# Altium schematic sheet 7I92ETH.SchDoc
size B
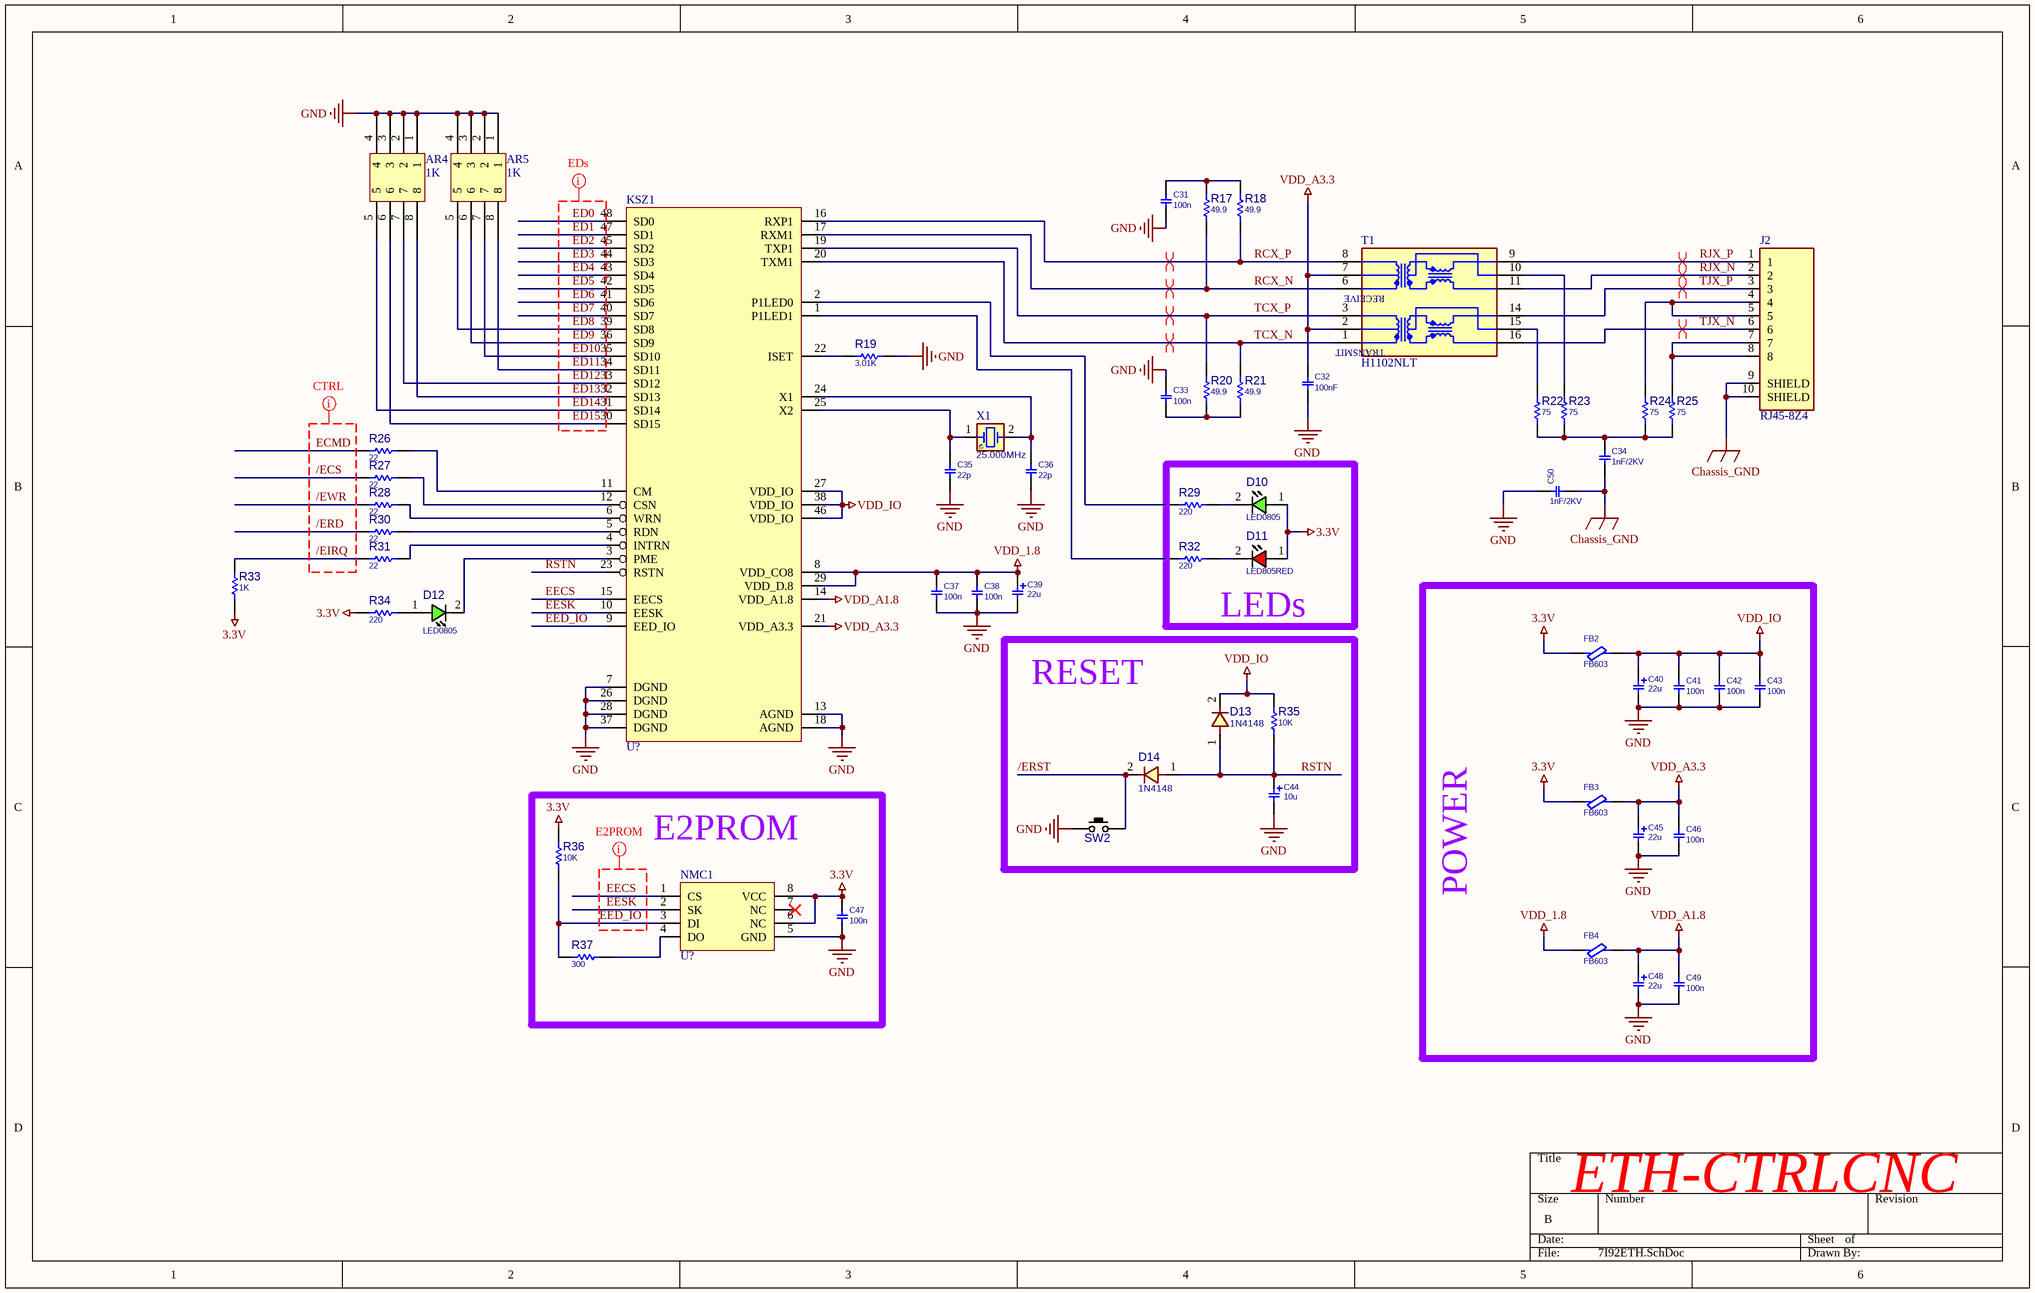
[diagram p0: 7I92ETH.SchDoc]

## Parts
AR4  1K  [RP0603X4]
AR5  1K  [RP0603X4]
C31  100n  [C0603]
C32  100nF  [C0603]
C33  100n  [C0603]
C34  1nF/2KV  [C1812]
C35  22p  [C0603]
C36  22p  [C0603]
C37  100n  [C0603]
C38  100n  [C0603]
C39  22u  [C_TN_3216]
C40  22u  [C_TN_3216]
C41  100n  [C0603]
C42  100n  [C0603]
C43  100n  [C0603]
C44  10u  [C_TN_3216]
C45  22u  [C_TN_3216]
C46  100n  [C0603]
C47  100n  [C0603]
C48  22u  [C_TN_3216]
C49  100n  [C0603]
C50  1nF/2KV  [C1812]
D10  LED0805  [LED0805]
D11  LED805RED  [LED0805RED]
D12  LED0805  [LED0805]
D13  1N4148  [D_SOD80]
D14  1N4148  [D_SOD80]
FB2  FB603  [L1206]
FB3  FB603  [L1206]
FB4  FB603  [L1206]
J2  RJ45-8Z4  [TE_RJ45-8Z4]
KSZ1  U?  [QFG50_48]
NMC1  U?  [SO_8]
R17  49.9  [R0603]
R18  49.9  [R0603]
R19  3.01K  [R0805]
R20  49.9  [R0603]
R21  49.9  [R0603]
R22  75  [R0805]
R23  75  [R0805]
R24  75  [R0805]
R25  75  [R0805]
R26  22  [R0603]
R27  22  [R0603]
R28  22  [R0603]
R29  220  [R0805]
R30  22  [R0603]
R31  22  [R0603]
R32  220  [R0805]
R33  1K  [R0603]
R34  220  [R0603]
R35  10K  [R0603]
R36  10K  [R0603]
R37  300  [R0603]
SW2  PUSHBUTTON  [SWPBS_SPST_6X3X5]  (value not drawn)
T1  H1102NLT  [XFMR_H1102NLT]
X1  25.000MHz  [XTLT_2]

## Blocks framed on the sheet
LEDs: D10 D11 R29 R32
POWER: C40-C43 C45 C46 C48 C49 FB2-FB4
RESET: C44 D13 D14 R35 SW2
E2PROM: C47 NMC1 R36 R37

## Nets
3.3V: C47.1 D10.1(ANODE) D11.1(ANODE) FB2.1 FB3.1 NMC1.6(NC) NMC1.8(VCC) R33.2 R34.2 R36.1
Chassis_GND: C34.2 C50.2 J2.9(SHIELD) J2.10(SHIELD)
GND: AR4.1 AR4.2 AR4.3 AR4.4 AR5.1 AR5.2 AR5.3 AR5.4 C31.2 C32.2 C33.1 C35.2 C36.2 C37.2 C38.2 C39.2 C40.2 C41.2 C42.2 C43.2 C44.2 C45.2 C46.2 C47.2 C48.2 C49.2 C50.1 KSZ1.7(DGND) KSZ1.13(AGND) KSZ1.18(AGND) KSZ1.26(DGND) KSZ1.28(DGND) KSZ1.37(DGND) NMC1.5(GND) R19.1 SW2.1(P1)
VDD_1.8: C37.1 C38.1 C39.1 FB4.1 KSZ1.8(VDD_CO8) KSZ1.29(VDD_D.8)
VDD_A1.8: C48.1 C49.1 FB4.2 KSZ1.14(VDD_A1.8)
VDD_A3.3: C32.1 C45.1 C46.1 FB3.2 KSZ1.21(VDD_A3.3) T1.2 T1.7
VDD_IO: C40.1 C41.1 C42.1 C43.1 D13.2 FB2.2 KSZ1.27(VDD_IO) KSZ1.38(VDD_IO) KSZ1.46(VDD_IO) R35.2
/ECS: R27.2
/EIRQ: R31.2 R33.1
/ERD: R30.2
/ERST: D14.2 SW2.2(P3)
/EWR: R28.2
ECMD: R26.2
ED0: KSZ1.48(SD0)
ED1: KSZ1.47(SD1)
ED2: KSZ1.45(SD2)
ED3: KSZ1.44(SD3)
ED4: KSZ1.43(SD4)
ED5: KSZ1.42(SD5)
ED6: KSZ1.41(SD6)
ED7: KSZ1.40(SD7)
ED8: AR5.5 KSZ1.39(SD8)
ED9: AR5.6 KSZ1.36(SD9)
ED10: AR5.7 KSZ1.35(SD10)
ED11: AR5.8 KSZ1.34(SD11)
ED12: AR4.7 KSZ1.33(SD12)
ED13: AR4.8 KSZ1.32(SD13)
ED14: AR4.5 KSZ1.31(SD14)
ED15: AR4.6 KSZ1.30(SD15)
EECS: KSZ1.15(EECS) NMC1.1(CS)
EED_IO: KSZ1.9(EED_IO) NMC1.3(DI) R36.2 R37.1
EESK: KSZ1.10(EESK) NMC1.2(SK)
RCX_N: KSZ1.17(RXM1) R17.1 T1.6
RCX_P: KSZ1.16(RXP1) R18.1 T1.8
RJX_N: J2.2 T1.11
RJX_P: J2.1 T1.9
RSTN: C44.1 D13.1 D14.1 KSZ1.23(RSTN) R35.1
TCX_N: KSZ1.20(TXM1) R21.2 T1.1
TCX_P: KSZ1.19(TXP1) R20.2 T1.3
TJX_N: J2.6 T1.16
TJX_P: J2.3 T1.14
NetC31_1: C31.1 R17.2 R18.2
NetC33_2: C33.2 R20.1 R21.1
NetC34_1: C34.1 R22.1 R23.1 R24.1 R25.1
NetC35_1: C35.1 KSZ1.25(X2) X1.1(OSC1)
NetC36_1: C36.1 KSZ1.24(X1) X1.2(OSC2)
NetD10_2: D10.2(CATHODE) R29.1
NetD11_2: D11.2(CATHODE) R32.1
NetD12_1: D12.1(ANODE) R34.1
NetD12_2: D12.2(CATHODE) KSZ1.3(PME)
NetJ2_4: J2.4 J2.5 R24.2
NetJ2_7: J2.7 J2.8 R25.2
NetKSZ1_1: KSZ1.1(P1LED1) R32.2
NetKSZ1_2: KSZ1.2(P1LED0) R29.2
NetKSZ1_4: KSZ1.4(INTRN) R31.1
NetKSZ1_5: KSZ1.5(RDN) R30.1
NetKSZ1_6: KSZ1.6(WRN) R28.1
NetKSZ1_11: KSZ1.11(CM) R26.1
NetKSZ1_12: KSZ1.12(CSN) R27.1
NetKSZ1_22: KSZ1.22(ISET) R19.2
NetNMC1_4: NMC1.4(DO) R37.2
NetR22_2: R22.2 T1.15
NetR23_2: R23.2 T1.10

Not connected (* = marked no-connect by the designer): NMC1 7(NC)*

## Layout directives
differential pair: RCX_N, RCX_P, RJX_N, RJX_P, TCX_N, TCX_P, TJX_N, TJX_P
net class EDs: ED0, ED1, ED2, ED3, ED4, ED5, ED6, ED7, ED8, ED9, ED10, ED11, ED12, ED13, ED14, ED15
net class CTRL: /ECS, /EIRQ, /ERD, /EWR, ECMD
net class E2PROM: EECS, EED_IO, EESK

## Notes on the sheet
- ETH-CTRLCNC
- (in symbol H1102NLT) RECEIVE; TRANSMIT

## Library data of the parts
AR4 AR5 = ARRAY*4
C31-C38 C41-C43 C46 C47 C49 C50 = CAP_SMD_MLCC: CAP, MLCC, 1nF, 50V, C0G, 10%, 0402; MANF: Murata; PARAM: C0G, 10%; PRICE: 100= 1.4$; DESC: -; MANF_P#: -; PARAM2: 50V; ASSEMBLY: ASSEMBLY
  C31 C33 C37 C38 C41-C43 C46 C47 C49: VALUE: 100n
  C32: VALUE: 100nF
  C34 C50: VALUE: 1nF/2KV
  C35 C36: VALUE: 22p
C39 C40 C44 C45 C48 = CAP_SMD_TAN: CAP, SMD, TAN,; PARAM: 25V
  C39 C40 C45 C48: VALUE: 22u
  C44: VALUE: 10u
D10 D12 = LED_SMD_0805: LED, SMD, 0805; DESC: DESCRIPTION; MANF_P#: MANF_PART#; PARAM2: 2.2V; MANF: MANF; ASSEMBLY: ASSEMBLY; PRICE: PRICE; VALUE: LED0805
D11 = LED_SMD_0805_RED: LED, SMD, 0805, RED; DESC: DESCRIPTION; MANF_P#: MANF_PART#; PARAM2: 2.2V; MANF: MANF; ASSEMBLY: ASSEMBLY; PRICE: 36t@Javan; VALUE: LED805RED
D13 D14 = DIODE_SMD_1N4148: DIODE, FAST SWTICHING, 0.3A, 0.5W; DESC: DESCRIPTION; PARAM: 75V; PARAM2: 300mA, 0.5W; MANF: MANF; ASSEMBLY: ASSEMBLY; PRICE: PRICE; MANF_P#: 1N4148; VALUE: 1N4148
FB2-FB4 = FBEAD_SMD: FERRITE_Bead, SMD; MANF: MURATA; PARAM: 120@100MHz; PARAM2: 1A; MANF_P#: BLM15AG121SN1D; VALUE: FB603
J2 = RJ45-8Z4: CONN MOD JACK 8P8C R/A SHIELDED; MF: {'manufacturer': u'TE Connectivity'}; Availability: Unavailable; Price: None; MP: RJ45-8Z4; Package: None; Value: *
KSZ1 = KSZ8851: ETHERNET IC
NMC1 = NMC9346: 1024 BYTE ERASABLE PROGRAMABLE MEMORY
R17-R37 = RES_SMD: RESISTOR, SMD; MANF_P#: RK73H1ETTP4701F; MANF: KOA SPEER; PARAM: 0.063W; DESC: DESCRIPTION; DIST#: MOUSER; PARAM2: 1%; ASSEMBLY: ASSEMBLY; PRICE: 100= 0.5$
  R17 R18 R20 R21: VALUE: 49.9
  R19: VALUE: 3.01K
  R22-R25: VALUE: 75
  R26-R28 R30 R31: VALUE: 22
  R29 R32 R34: VALUE: 220
  R33: VALUE: 1K
  R35 R36: VALUE: 10K
  R37: VALUE: 300
SW2 = SWPBS_SPST_6X3X4: SWITCH, PUSH BUTTON, TACTILE, SMD, SPST, 6X3.5X4.3mm; MANF: Panasonic; DESC: DESCRIPTION; MANF_P#: EVQ-PNF04M; VALUE: PUSHBUTTON; ASSEMBLY: ASSEMBLY; PARAM: PARAM; PRICE: PRICE
T1 = H1102NLT: Telecom Transformer 1: 1/1: 1 0.65Ohm Prim. DCR 0.65Ohm Sec. DCR 16Term. Gull Wing SMD; MF: {'manufacturer': u'Pulse Electronics Network'}; MP: H1102NLT; Package: None; Price: None; Availability: Unavailable; Value: *
X1 = XTL_2_HC49_THD: Crystal MOST POPULAR ABL HC49 PACKAGE; VALUE: 25.000MHz